# EAGLE design LaserExposer (EAGLE 7.6.0)
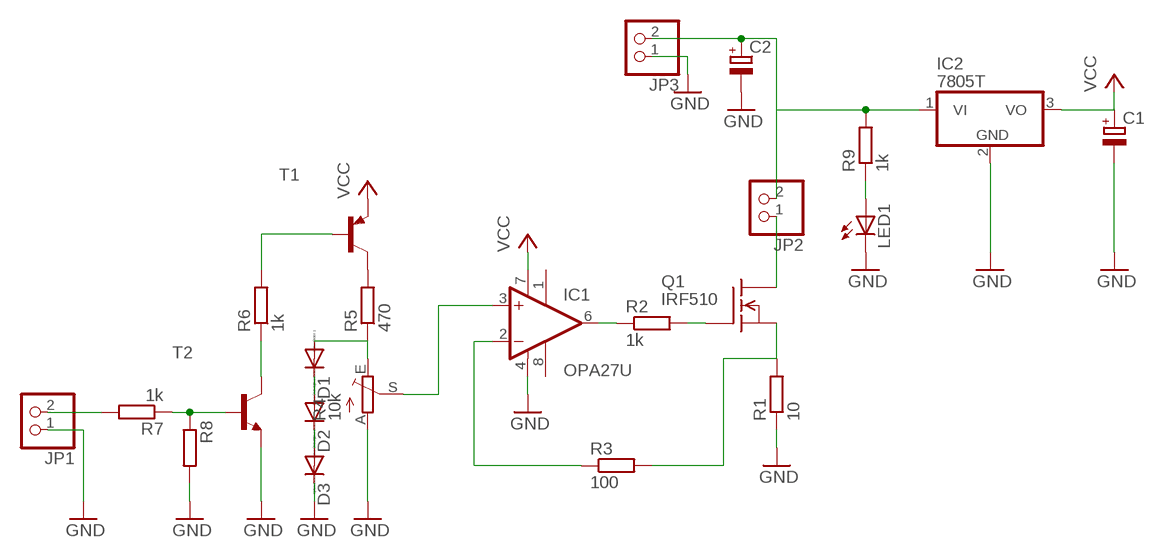
[diagram p0: schematic, sheet 1]

## Parts
C1  CPOL-EUE5-10.5  [E5-10,5]
C2  CPOL-EUE5-10.5  [E5-10,5]
D1  DIODE-DO214AA  [DO214AA]
D2  DIODE-DO214AA  [DO214AA]
D3  DIODE-DO214AA  [DO214AA]
IC1  OPA27U  [SO08]
IC2  7805T  [TO220H]
JP1  PINHD-1X2  [1X02]
JP2  PINHD-1X2  [1X02]
JP3  PINHD-1X2  [1X02]
LED1  LEDCHIP-LED0805  [CHIP-LED0805]
Q1  IRF510  [TO220]
R1  10  R-EU_0207/10  [0207/10]
R2  1k  R-EU_R1206  [R1206]
R3  100  R-EU_R1206  [R1206]
R4  10k  TRIM_EU-B90P  [SP19L]
R5  470  R-EU_R1206  [R1206]
R6  1k  R-EU_R1206  [R1206]
R7  1k  R-EU_R1206  [R1206]
R8  R-EU_R1206  [R1206]
R9  1k  R-EU_R1206  [R1206]
T1  MMBT3906LT1-PNP-SOT23-BEC  [SOT23-BEC]
T2  BC817-16-NPN-SOT23-BEC  [SOT23-BEC]

## Nets
GND: C1.- C2.- D3.C IC1.4(V-) IC2.2(GND) JP1.1 JP3.1 LED1.C R1.1 R4.A R8.2 T2.E
N$1: Q1.3(S) R1.2 R3.2
N$2: Q1.1(G) R2.2
N$3: IC1.2(-IN) R3.1
N$4: IC1.6(OUT) R2.1
N$5: IC1.3(+IN) R4.S
N$6: D1.A R4.E R5.1
N$7: R5.2 T1.C
N$8: R6.2 T1.B
N$9: R6.1 T2.C
N$10: R7.1 R8.1 T2.B
N$11: JP1.2 R7.2
N$12: D1.C D2.A
N$13: D2.C D3.A
N$14: JP2.1 Q1.2(D)
N$15: C2.+ IC2.1(VI) JP2.2 JP3.2 R9.2
N$16: LED1.A R9.1
VCC: C1.+ IC1.7(V+) IC2.3(VO) T1.E
Unconnected: IC1.1(OFF1) IC1.8(OFF2)

## Library data of the parts
C1 C2 = rcl:CPOL-EU: POLARIZED CAPACITOR, European symbol
D1-D3 = diode:DIODE-: DIODE
IC1 = linear:OPA*?: Ultra-Low Noise, Precision OP AMP Source: http://focus.ti.com/lit/ds/symlink/opa27.pdf http://focus.ti.com .. opa241.pdf
IC2 = linear:78*: Positive VOLTAGE REGULATOR Source: http://cache.national.com/ds/LM/LM78L05.pdf http://www.fairchildsemi.com/ds/LM/LM7805.pdf
JP1-JP3 = pinhead:PINHD-1X2: PIN HEADER
LED1 = led:LED: LED OSRAM: - CHIPLED LG R971, LG N971, LY N971, LG Q971, LY Q971, LO R971, LY R971 LH N974, LH R974 LS Q976, LO Q976, LY Q976 LO Q996 - Hyper CHIPLED LW Q18S LB Q993, LB Q99A, LB R99A - SideLED LS A670, LO A670, LY A670, LG A670, LP A670 LB A673, LV A673, LT A673, LW A673 LH A674 LY A675 LS A676, LA A676, LO A676, LY A676, LW A676 LS A679, LY A679, LG A679 - Hyper Micro SIDELED® LS Y876, LA Y876, LO Y876, LY Y876 LT Y87S - SmartLED LW L88C, LW L88S LB L89C, LB L89S, LG L890 LS L89K, LO L89K, LY L89K LS L896, LA L896, LO L896, LY L896 - TOPLED LS T670, LO T670, LY T670, LG T670, LP T670 LSG T670, LSP T670, LSY T670, LOP T670, LYG T670 LG T671, LOG T671, LSG T671 LB T673, LV T673, LT T673, LW T673 LH T674 LS T676, LA T676, LO T676, LY T676, LB T676, LH T676, LSB T676, LW T676 LB T67C, LV T67C, LT T67C, LS T67K, LO T67K, LY T67K, LW E67C LS E67B, LA E67B, LO E67B, LY E67B, LB E67C, LV E67C, LT E67C LW T67C LS T679, LY T679, LG T679 LS T770, LO T770, LY T770, LG T770, LP T770 LB T773, LV T773, LT T773, LW T773 LH T774 LS E675, LA E675, LY E675, LS T675 LS T776, LA T776, LO T776, LY T776, LB T776 LHGB T686 LT T68C, LB T68C - Hyper Mini TOPLED® LB M676 - Mini TOPLED Santana® LG M470 LS M47K, LO M47K, LY M47K Source: http://www.osram.convergy.de LUXEON: - LUMILED® LXK2-PW12-R00, LXK2-PW12-S00, LXK2-PW14-U00, LXK2-PW14-V00 LXK2-PM12-R00, LXK2-PM12-S00, LXK2-PM14-U00 LXK2-PE12-Q00, LXK2-PE12-R00, LXK2-PE12-S00, LXK2-PE14-T00, LXK2-PE14-U00 LXK2-PB12-K00, LXK2-PB12-L00, LXK2-PB12-M00, LXK2-PB14-N00, LXK2-PB14-P00, LXK2-PB14-Q00 LXK2-PR12-L00, LXK2-PR12-M00, LXK2-PR14-Q00, LXK2-PR14-R00 LXK2-PD12-Q00, LXK2-PD12-R00, LXK2-PD12-S00 LXK2-PH12-R00, LXK2-PH12-S00 LXK2-PL12-P00, LXK2-PL12-Q00, LXK2-PL12-R00 Source: www.luxeon.com KINGBRIGHT: KA-3528ASYC Source: www.kingbright.com
Q1 = transistor-fet:IRF510: N-Channel Enhancement MOSFET (HEXFET); 100V; 5,6A; 0,54Ohm
R1-R3 R5-R9 = rcl:R-EU_: RESISTOR, European symbol
R4 = pot:TRIM_EU-: POTENTIOMETER
T1 = transistor:*-PNP-: PNP Transistror
T2 = transistor:*-NPN-: NPN Transistror BF959 corrected 2008.03.06

## Board
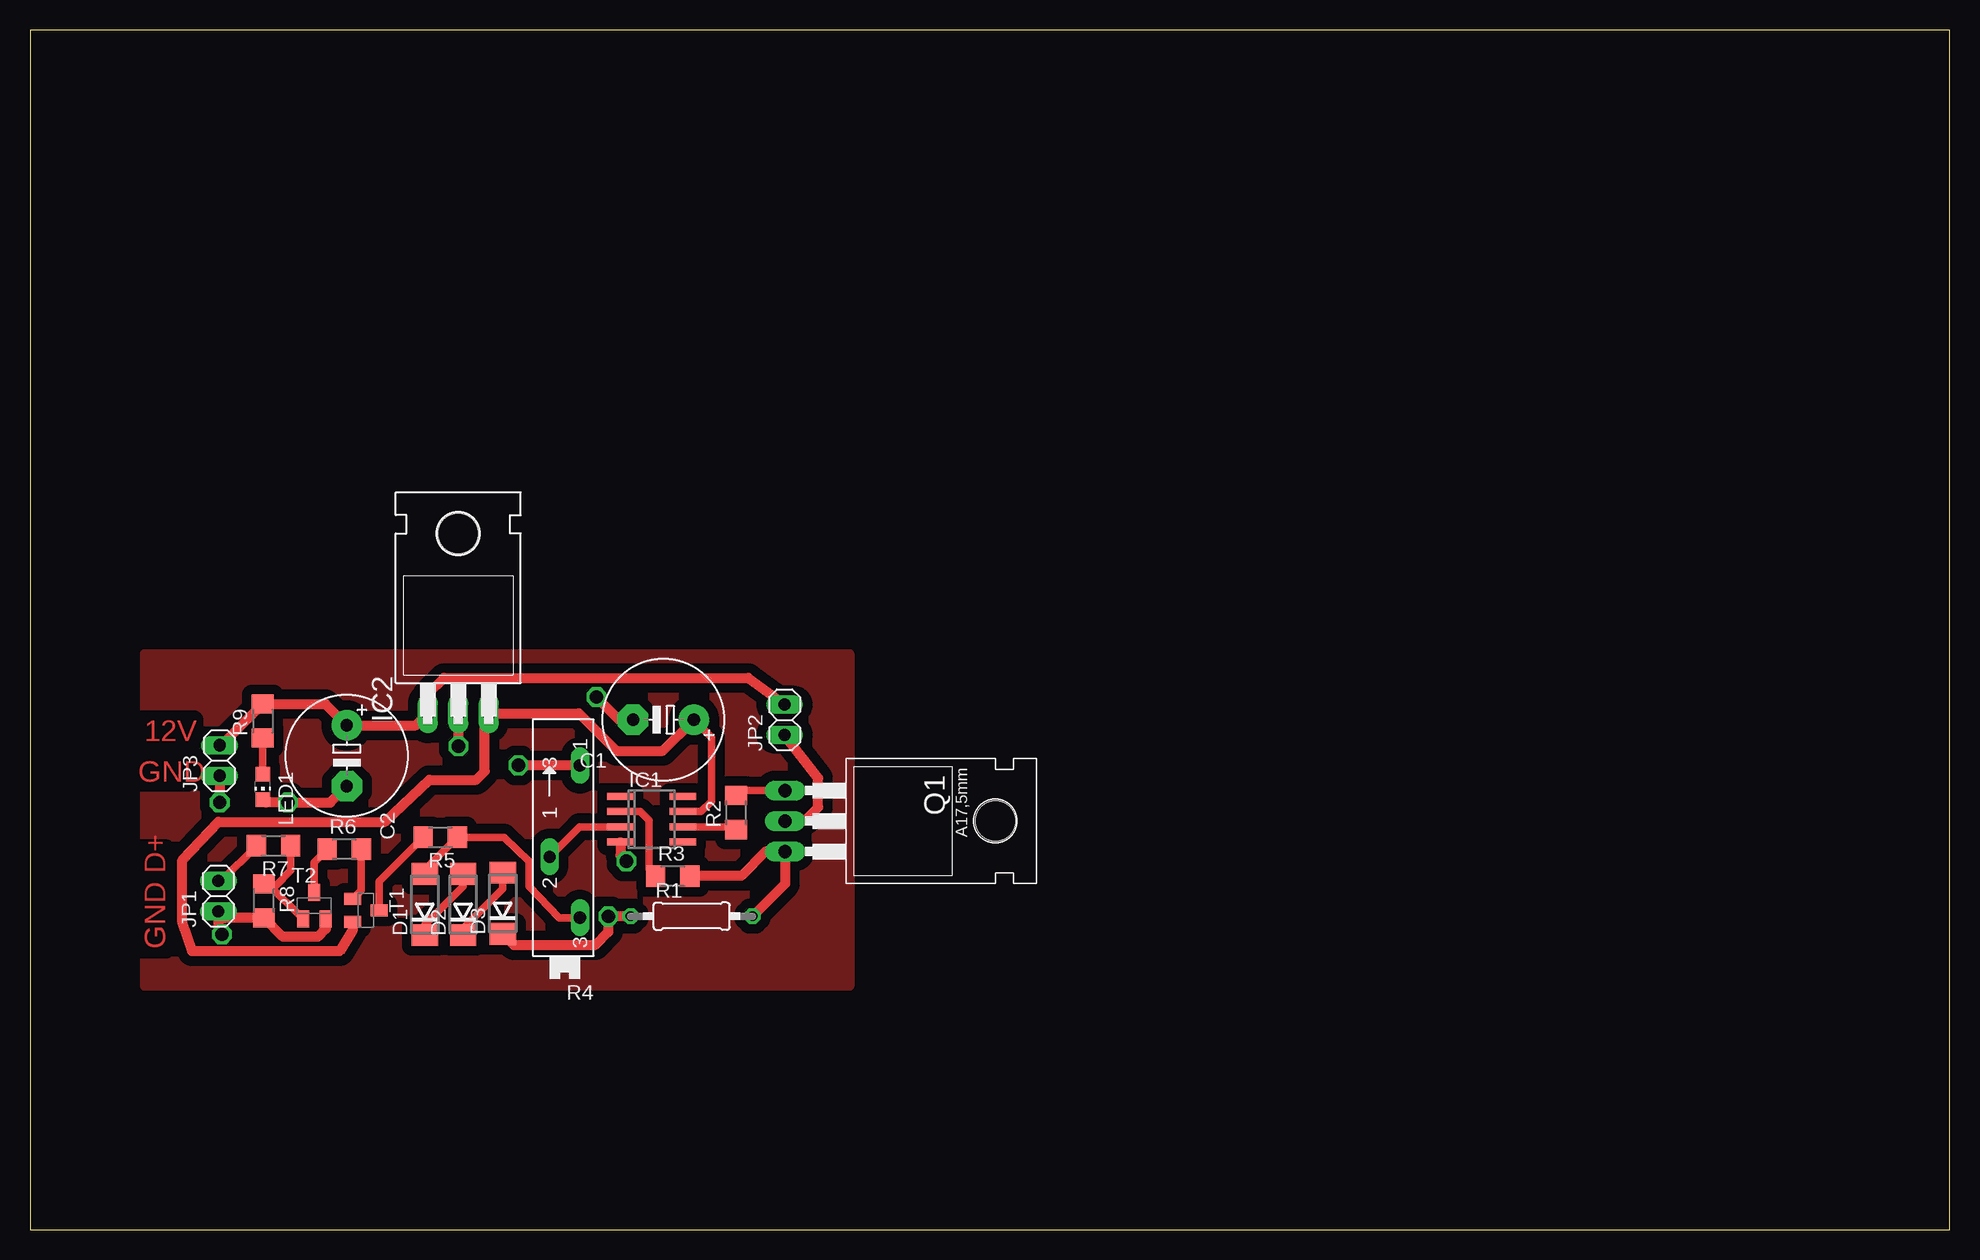
[diagram p1: board, top side]
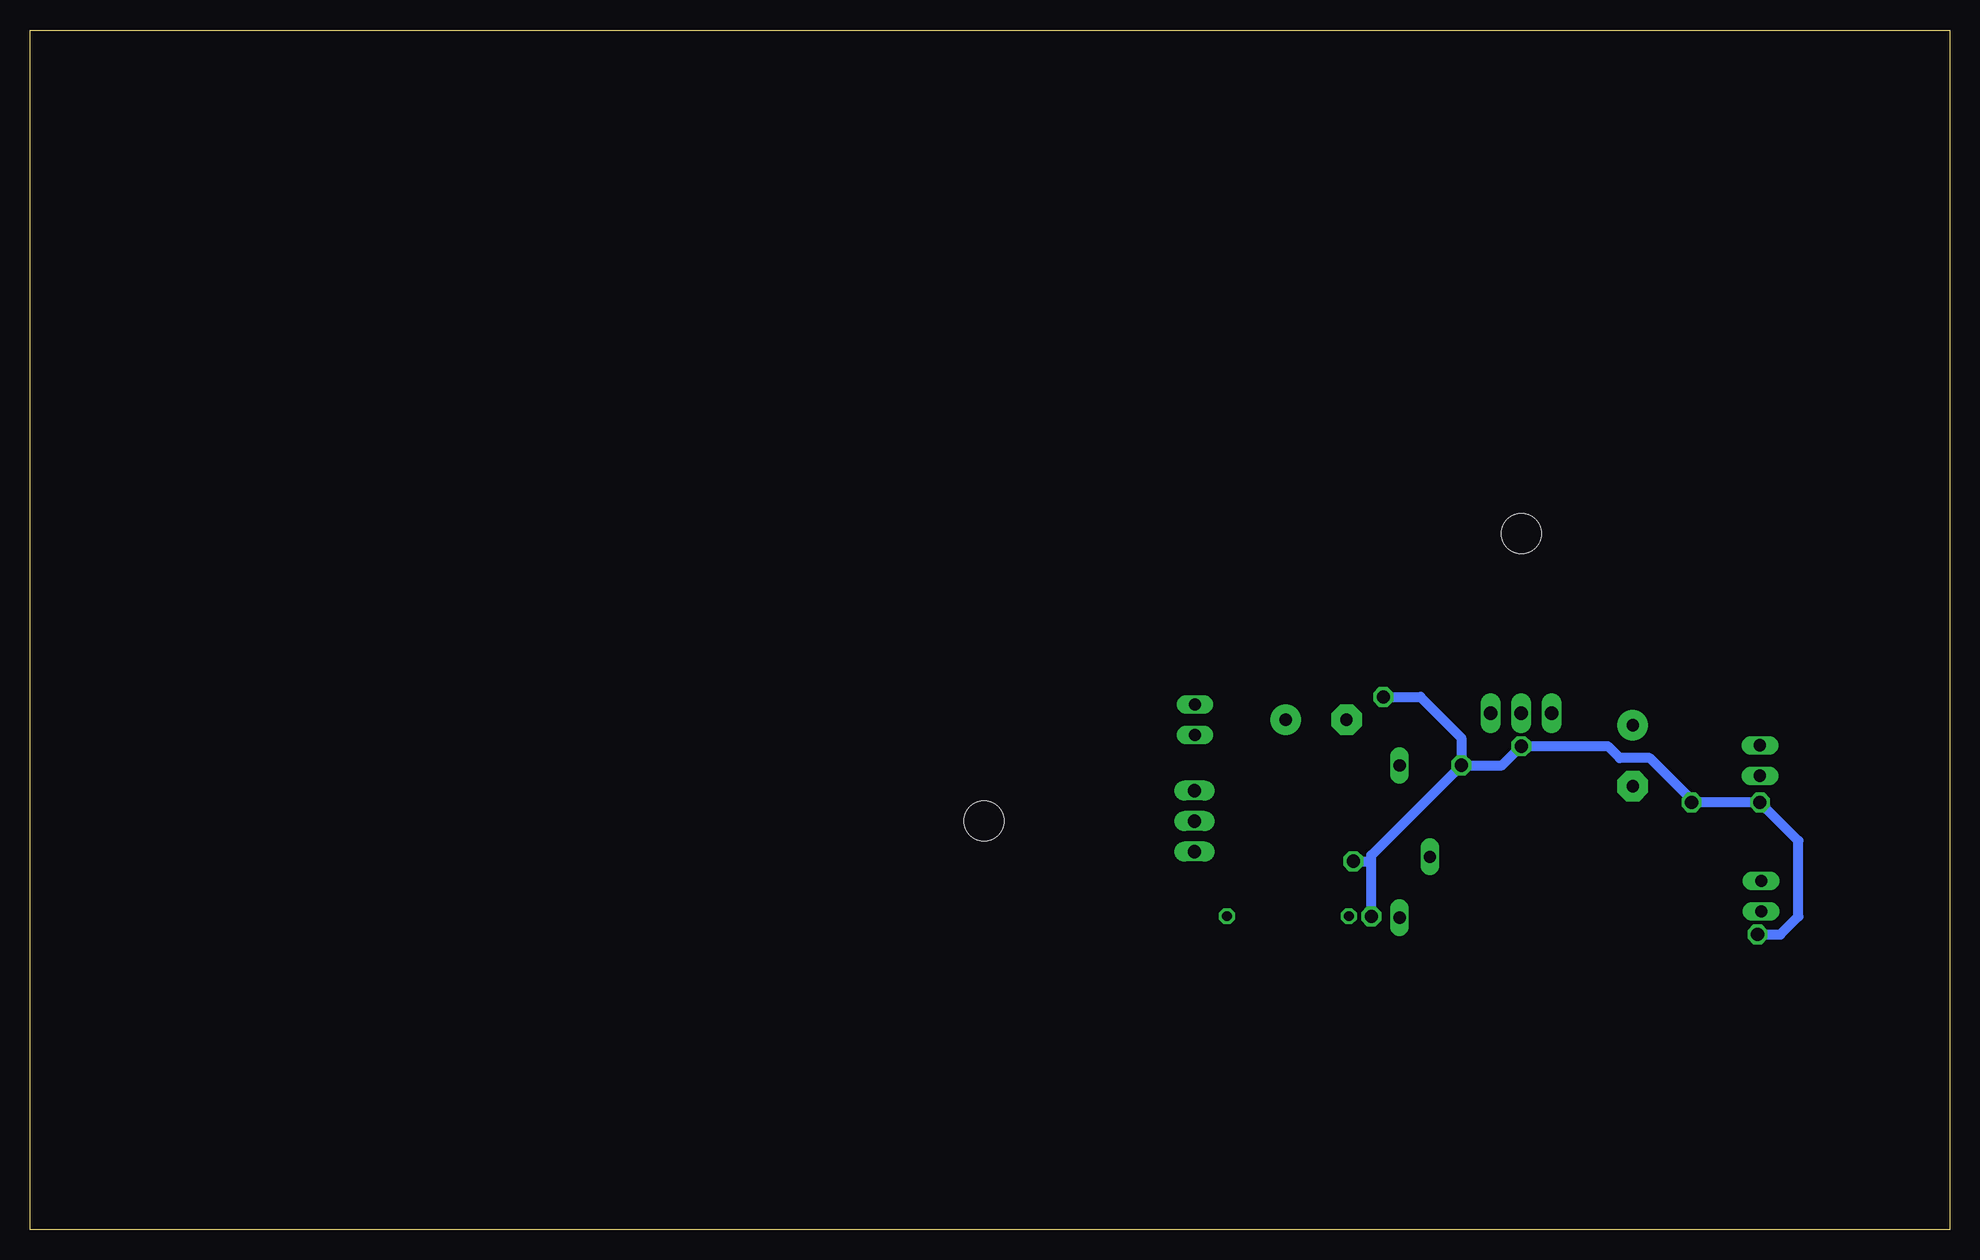
[diagram p2: board, bottom side, seen from below]

Size 160 x 100 mm. Coordinates in mm from the lower left corner, seen from the top.
Outline: 0,0 160,0 160,100 0,100 0,0
Copper layers (1*16): Top 0.035mm / dielectric 1.5mm / Bottom 0.035mm
Design rules "default": minimum track width 10mil, minimum drill 24mil, track to track 8mil, track to pad 8mil, pad to pad 8mil, via to via 8mil, smd to smd 8mil, copper to edge 40mil, drill to drill 8mil, minimum pad ring 10mil, minimum via ring 8mil, stop-mask expansion 4mil, vias tented up to drill 0mil, thermal gap 10mil

### Footprints (pad centres in the part's own frame; a part is rotated, then mirrored left to right if it is on the bottom)
E5-10,5 = drill 1.016 pad 2.54: + -2.54,0 | drill 1.016 pad 2.54 octagon: - 2.54,0
DO214AA = smd 1.8 x 2.2: A 2.55,0; C -2.55,0
SO08 = smd 0.6 x 2.2: 1 -1.905,-2.6; 2 -0.635,-2.6; 3 0.635,-2.6; 4 1.905,-2.6; 5 1.905,2.6; 6 0.635,2.6; 7 -0.635,2.6; 8 -1.905,2.6
TO220H = drill 1.118 long: 1 -2.54,-10.16; 2 0,-10.16; 3 2.54,-10.16 | hole 3.302: 0,4.826
1X02 = drill 1.016 long: 1 -1.27,0; 2 1.27,0
CHIP-LED0805 = smd 1.2 x 1.2: A 0,-1.05; C 0,1.05
TO220 = drill 1.118 long: 1 -2.54,-6.35; 2 0,-6.35; 3 2.54,-6.35 | hole 3.302: 0,11.176
0207/10 = drill 0.813 octagon: 1 -5.08,0; 2 5.08,0
R1206 = smd 1.6 x 1.803: 1 -1.422,0; 2 1.422,0
SP19L = drill 1.016 long: A 5.715,-1.27; E -6.985,-1.27; S -1.905,1.27
SOT23-BEC = smd 1 x 1.4: B -0.95,-1.1; C 0,1.1; E 0.95,-1.1

### Placement (x,y rotation side)
C1  52.8,42.5 180 top
C2  26.4,39.5 270 top
D1  32.9,27.1 90 top
D2  36.1,27.1 90 top
D3  39.4,27.2 90 top
IC1  51.81,34.21 270 top
IC2  35.7,53.2 0 top
JP1  15.7,27.8 90 top
JP2  62.9,42.5 90 top
JP3  15.8,39.1 90 top
LED1  19.4,36.9 180 top
Q1  69.29,34.05 270 top
R1  55.15,26.12 0 top
R2  58.85,34.76 90 top
R3  53.58,29.45 0 top
R4  44.57,32.98 90 top
R5  34.2,32.7 180 top
R6  26.2,31.7 0 top
R7  20.3,32 180 top
R8  19.5,27.4 270 top
R9  19.4,42.4 90 top
T1  28,26.6 270 top
T2  23.7,27 0 top

### Tracks (layer width: path | path; a pad name or v marks a point on that pad's centre or on a via)
GND  (via drill 1.1 pad 0.25)
  Top 0.813: JP3.1 v15.8,35.6 | C2.- 25.04,35.6 v21.5,35.6 19.65,35.6 LED1.C | IC2.2 v35.7,40.3 | R4.A v40.7,38.7 | C1.- 49.1,42.5 v47.2,44.4 | R1.1 48.22,26.12 v48.2,26.1 48.2,24.8 47.1,23.7 40.35,23.7 D3.C | T2.E 24.65,25.05 24,24.4 21.08,24.4 R8.2 16.25,25.98 JP1.1 15.7,24.9 v16,24.6 | IC1.4 49.21,31.19 v49.7,30.7
  Bottom 0.813: v40.7,38.7 37.3,38.7 v35.7,40.3 28.5,40.3 27.5,39.3 25,39.3 21.5,35.8 v21.5,35.6 v15.8,35.6 12.6,32.4 12.6,26.1 14.1,24.6 v16,24.6 | v47.2,44.4 44.1,44.4 40.7,41 v40.7,38.7 | v48.2,26.1 48.2,30.6 | 48.2,30.6 48.2,31.2 v40.7,38.7 | v49.7,30.7 48.3,30.7 48.2,30.6
N$1
  Top 0.813: R1.2 62.94,28.83 Q1.3 61.31,31.51 59.3,29.5 55.05,29.5 R3.2
N$2
  Top 0.61: Q1.1 59.26,36.59 R2.2
N$3
  Top 0.61: IC1.2 50.85,34.84 51.6,34.1 51.6,30.01 R3.1
N$4
  Top 0.61: IC1.6 58.61,33.58 R2.1
N$5
  Top 0.61: IC1.3 45.8,33.58 R4.S
N$6
  Top 0.61: D1.A 32.9,29.98 R5.1 39.5,32.7 41.6,30.7 41.6,28.6 44.1,26 R4.E
N$7
  Top 0.61: T1.C 29.1,29.02 R5.2
N$8
  Top 0.61: R6.2 27.62,28.27 T1.B
N$9
  Top 0.61: T2.C 23.7,30.62 R6.1
N$10
  Top 0.61: R7.1 21.72,29.92 20.5,28.7 19.62,28.7 R8.1 19.83,28.82 T2.B
N$11
  Top 0.61: JP1.2 15.95,29.07 R7.2
N$12
  Top 0.61: D1.C 32.9,25.4 36.1,28.6 D2.A
N$13
  Top 0.61: D2.C 36.1,25.1 39.4,28.4 D3.A
N$14
  Top 0.813: Q1.2 63,34.1 64.6,34.1 65.7,35.2 65.7,37.63 JP2.1
N$15
  Top 0.813: JP3.2 15.95,40.37 R9.2 24.62,43.82 C2.+ 32.16,42.04 IC2.1 33.16,44.66 34.5,46 59.87,46 JP2.2
N$16
  Top 0.61: R9.1 LED1.A
N$17
  pour Top (isolate 0.813): 68.3,48 68.3,20.3 9.6,20.3 9.6,48
VCC
  Top 0.61: IC1.7 55.95,34.84 56.8,35.7 56.8,41.04 C1.+
  Top 0.813: C1.+ 52.74,39.9 48.9,39.9 45.76,43.04 IC2.3 37.9,42.7 37.9,38.2 37.2,37.5 33.3,37.5 29.6,34 15.7,34 12.7,30.8 12.7,25.6 13.5,23.2 25.8,23.2 26.9,25 T1.E

### Text on the board
Top: 12V | GND | GND D+